# Altium schematic sheet Network.SchDoc
size A4
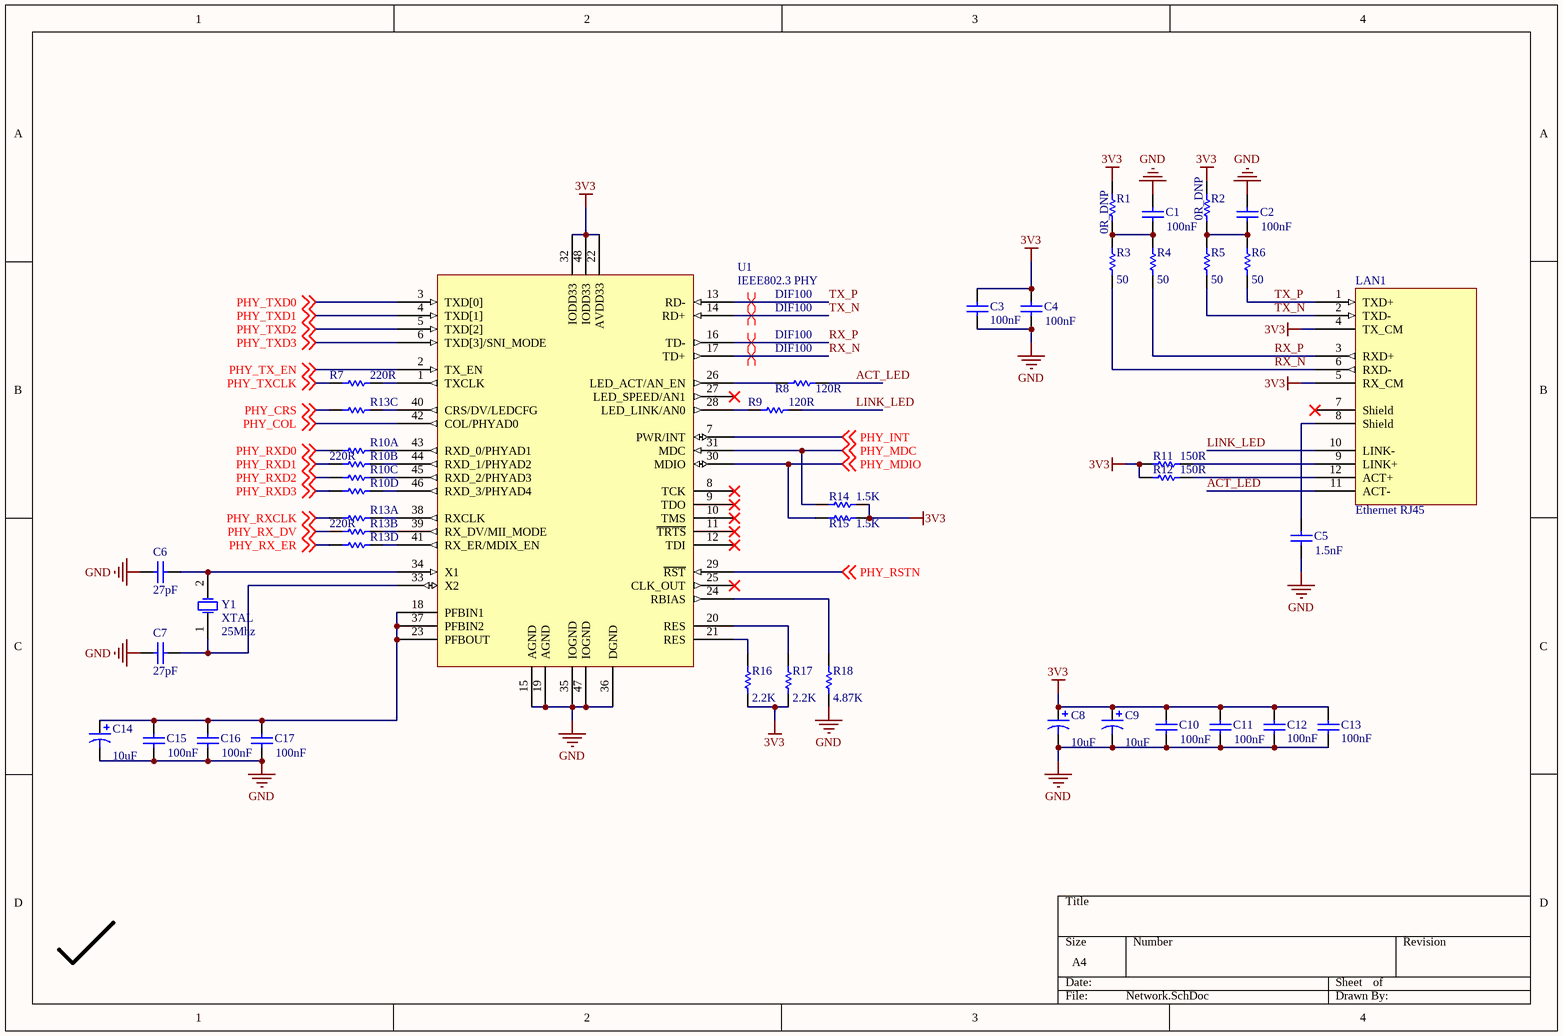
[diagram p0: Network.SchDoc]

## Parts
C1  value 100nF  [0603PKG]  (hidden comment: Cap)
C2  value 100nF  [0603PKG]  (hidden comment: Cap)
C3  value 100nF  [0603PKG]  (hidden comment: Cap)
C4  value 100nF  [0603PKG]  (hidden comment: Cap)
C5  value 1.5nF  [C0805]  (hidden comment: Cap)
C6  value 27pF  [C0805]  (hidden comment: Cap)
C7  value 27pF  [C0805]  (hidden comment: Cap)
C8  value 10uF  [3216X18N]  (hidden comment: Cap Pol3)
C9  value 10uF  [3216X18N]  (hidden comment: Cap Pol3)
C10  value 100nF  [0603PKG]  (hidden comment: Cap)
C11  value 100nF  [0603PKG]  (hidden comment: Cap)
C12  value 100nF  [0603PKG]  (hidden comment: Cap)
C13  value 100nF  [0603PKG]  (hidden comment: Cap)
C14  value 10uF  [3216X18N]  (hidden comment: Cap Pol3)
C15  value 100nF  [0603PKG]  (hidden comment: Cap)
C16  value 100nF  [0603PKG]  (hidden comment: Cap)
C17  value 100nF  [0603PKG]  (hidden comment: Cap)
LAN1  Ethernet RJ45  [RJ45]
R1  value 0R_DNP  [C0805]  (hidden comment: Res Semi)
R2  value 0R_DNP  [C0805]  (hidden comment: Res Semi)
R3  value 50  [C0805]  (hidden comment: Res Semi)
R4  value 50  [C0805]  (hidden comment: Res Semi)
R5  value 50  [C0805]  (hidden comment: Res Semi)
R6  value 50  [C0805]  (hidden comment: Res Semi)
R7  value 220R  [0603PKG]  (hidden comment: Res Semi)
R8  value 120R  [C0805]  (hidden comment: Res Semi)
R9  value 120R  [C0805]  (hidden comment: Res Semi)
R10  value 220R  [ARA4x0603]  (hidden comment: ChipArray_4x)  (parts A,B,C,D of 4)
R11  value 150R  [C0805]  (hidden comment: Res Semi)
R12  value 150R  [C0805]  (hidden comment: Res Semi)
R13  value 220R  [ARA4x0603]  (hidden comment: ChipArray_4x)  (parts A,B,C,D of 4)
R14  value 1.5K  [0603PKG]  (hidden comment: Res Semi)
R15  value 1.5K  [0603PKG]  (hidden comment: Res Semi)
R16  value 2.2K  [0603PKG]  (hidden comment: Res Semi)
R17  value 2.2K  [0603PKG]  (hidden comment: Res Semi)
R18  value 4.87K  [C1206]  (hidden comment: Res Semi)
U1  IEEE802.3 PHY  [LQFP48]
Y1  XTAL  value 25Mhz  [SMD_Crystal]

## Nets
3V3: C3.1 C4.2 C8.1 C9.1 C10.2 C11.2 C12.2 C13.2 LAN1.4(TX_CM) LAN1.5(RX_CM) R1.2 R2.2 R11.1 R12.1 R14.2 R15.1 R16.1 R17.1 U1.22(AVDD33) U1.32(IODD33) U1.48(IODD33)
GND: C1.2 C2.2 C3.2 C4.1 C5.1 C6.2 C7.2 C8.2 C9.2 C10.1 C11.1 C12.1 C13.1 C14.2 C15.1 C16.1 C17.1 R18.1 U1.15(AGND) U1.19(AGND) U1.35(IOGND) U1.36(DGND) U1.47(IOGND)
ACT_LED: LAN1.11(ACT-) R8.2
LINK_LED: LAN1.10(LINK-) R9.2
PHY_COL: U1.42(COL/PHYAD0) ; off-sheet PHY_COL
PHY_CRS: R13.3(R3) ; off-sheet PHY_CRS
PHY_INT: U1.7(PWR/INT) ; off-sheet PHY_INT
PHY_MDC: R14.1 U1.31(MDC) ; off-sheet PHY_MDC
PHY_MDIO: R15.2 U1.30(MDIO) ; off-sheet PHY_MDIO
PHY_RSTN: U1.29(~{RST}) ; off-sheet PHY_RSTN
PHY_RX_DV: R13.2(R2) ; off-sheet PHY_RX_DV
PHY_RX_ER: R13.4(R4) ; off-sheet PHY_RX_ER
PHY_RXCLK: R13.1(R1) ; off-sheet PHY_RXCLK
PHY_RXD0: R10.1(R1) ; off-sheet PHY_RXD0
PHY_RXD1: R10.2(R2) ; off-sheet PHY_RXD1
PHY_RXD2: R10.3(R3) ; off-sheet PHY_RXD2
PHY_RXD3: R10.4(R4) ; off-sheet PHY_RXD3
PHY_TX_EN: U1.2(TX_EN) ; off-sheet PHY_TX_EN
PHY_TXCLK: R7.1 ; off-sheet PHY_TXCLK
PHY_TXD0: U1.3(TXD[0]) ; off-sheet PHY_TXD0
PHY_TXD1: U1.4(TXD[1]) ; off-sheet PHY_TXD1
PHY_TXD2: U1.5(TXD[2]) ; off-sheet PHY_TXD2
PHY_TXD3: U1.6(TXD[3]/SNI_MODE) ; off-sheet PHY_TXD3
RX_N: LAN1.6(RXD-) R3.1 U1.17(TD+)
RX_P: LAN1.3(RXD+) R4.1 U1.16(TD-)
TX_N: LAN1.2(TXD-) R5.1 U1.14(RD+)
TX_P: LAN1.1(TXD+) R6.1 U1.13(RD-)
NetC1_1: C1.1 R1.1 R3.2 R4.2
NetC2_1: C2.1 R2.1 R5.2 R6.2
NetC5_2: C5.2 LAN1.8(Shield)
NetC6_1: C6.1 U1.34(X1) Y1.2(OSC2)
NetC7_1: C7.1 U1.33(X2) Y1.1(OSC1)
NetC14_1: C14.1 C15.2 C16.2 C17.2 U1.18(PFBIN1) U1.23(PFBOUT) U1.37(PFBIN2)
NetLAN1_9: LAN1.9(LINK+) R11.2
NetLAN1_12: LAN1.12(ACT+) R12.2
NetR7_2: R7.2 U1.1(TXCLK)
NetR8_1: R8.1 U1.26(LED_ACT/AN_EN)
NetR9_1: R9.1 U1.28(LED_LINK/AN0)
NetR10_5: R10.5(R4) U1.46(RXD_3/PHYAD4)
NetR10_6: R10.6(R3) U1.45(RXD_2/PHYAD3)
NetR10_7: R10.7(R2) U1.44(RXD_1/PHYAD2)
NetR10_8: R10.8(R1) U1.43(RXD_0/PHYAD1)
NetR13_5: R13.5(R4) U1.41(RX_ER/MDIX_EN)
NetR13_6: R13.6(R3) U1.40(CRS/DV/LEDCFG)
NetR13_7: R13.7(R2) U1.39(RX_DV/MII_MODE)
NetR13_8: R13.8(R1) U1.38(RXCLK)
NetR16_2: R16.2 U1.21(RES)
NetR17_2: R17.2 U1.20(RES)
NetR18_2: R18.2 U1.24(RBIAS)

Not connected (* = marked no-connect by the designer): LAN1 7(Shield)*; U1 8(TCK)* 9(TDO)* 10(TMS)* 11(~{TRTS})* 12(TDI)* 25(CLK_OUT)* 27(LED_SPEED/AN1)*

## Layout directives
differential pair; net class DIF100: RX_N, RX_P, TX_N, TX_P

## Library data of the parts
C1-C7 C10-C13 C15-C17 = Cap: Capacitor; Published: 8-Jun-2000; LatestRevisionDate: 17-Jul-2002; LatestRevisionNote: Re-released for DXP Platform.; PackageReference: RAD-0.3; Publisher: Altium Limited; PackageDescription: Radial Cap, Thru-Hole; 2 Leads; 0.3 in Pin Spacing
C8 C9 C14 = Cap Pol3: Polarized Capacitor (Surface Mount); Published: 8-Jun-2000; LatestRevisionDate: 29-May-2009; LatestRevisionNote: IPC-7351 Footprint Added.; PackageReference: C0805; Publisher: Altium Limited; PackageDescription: Chip Capacitor
LAN1 = Ethernet_RJ45
R1-R9 R11 R12 R14-R18 = Res Semi: Semiconductor Resistor; Published: 8-Jun-2000; LatestRevisionDate: 17-Jul-2002; LatestRevisionNote: Re-released for DXP Platform.; PackageReference: AXIAL-0.5; Publisher: Altium Limited; PackageDescription: Axial Device, Thru-Hole; 2 Leads; 0.5 in Pin Spacing
U1 = DP83848C
Y1 = XTAL: Crystal Oscillator; Published: 8-Jun-2000; LatestRevisionDate: 17-Jul-2002; LatestRevisionNote: Re-released for DXP Platform.; PackageReference: R38; Publisher: Altium Limited; PackageDescription: Crystal, Thru-Hole; 2 Leads; Body 3.1 x 8.2 mm (Dia.xH)